# Altium schematic sheet COVER PAGE.SchDoc
size A; SheetNumber: 1; SheetTotal: 3
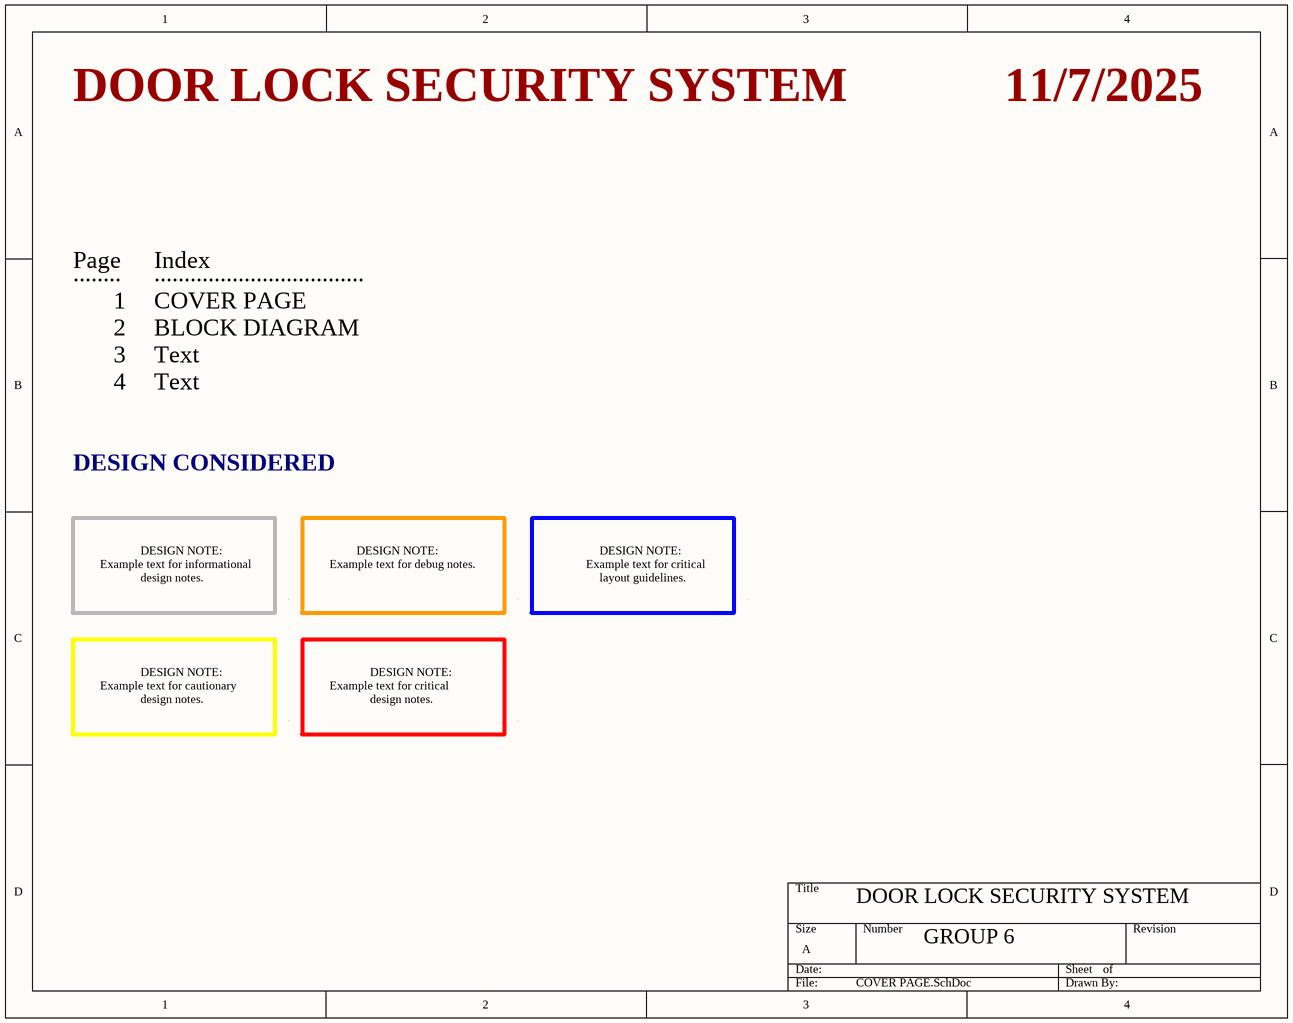
[diagram p0: COVER PAGE.SchDoc]

## Notes on the sheet
- DOOR LOCK SECURITY SYSTEM
- 11/7/2025
- Page
- ........
- Index
- ...................................
- 1
- 2
- 3
- COVER PAGE
- BLOCK DIAGRAM
- Text
- 4
- DESIGN CONSIDERED
- Example text for informational
- DESIGN NOTE:
- Example text for debug notes.
- Example text for critical
- design notes.
- layout guidelines.
- Example text for cautionary
- GROUP 6